# EAGLE schematic pwr (EAGLE 7.5.0)
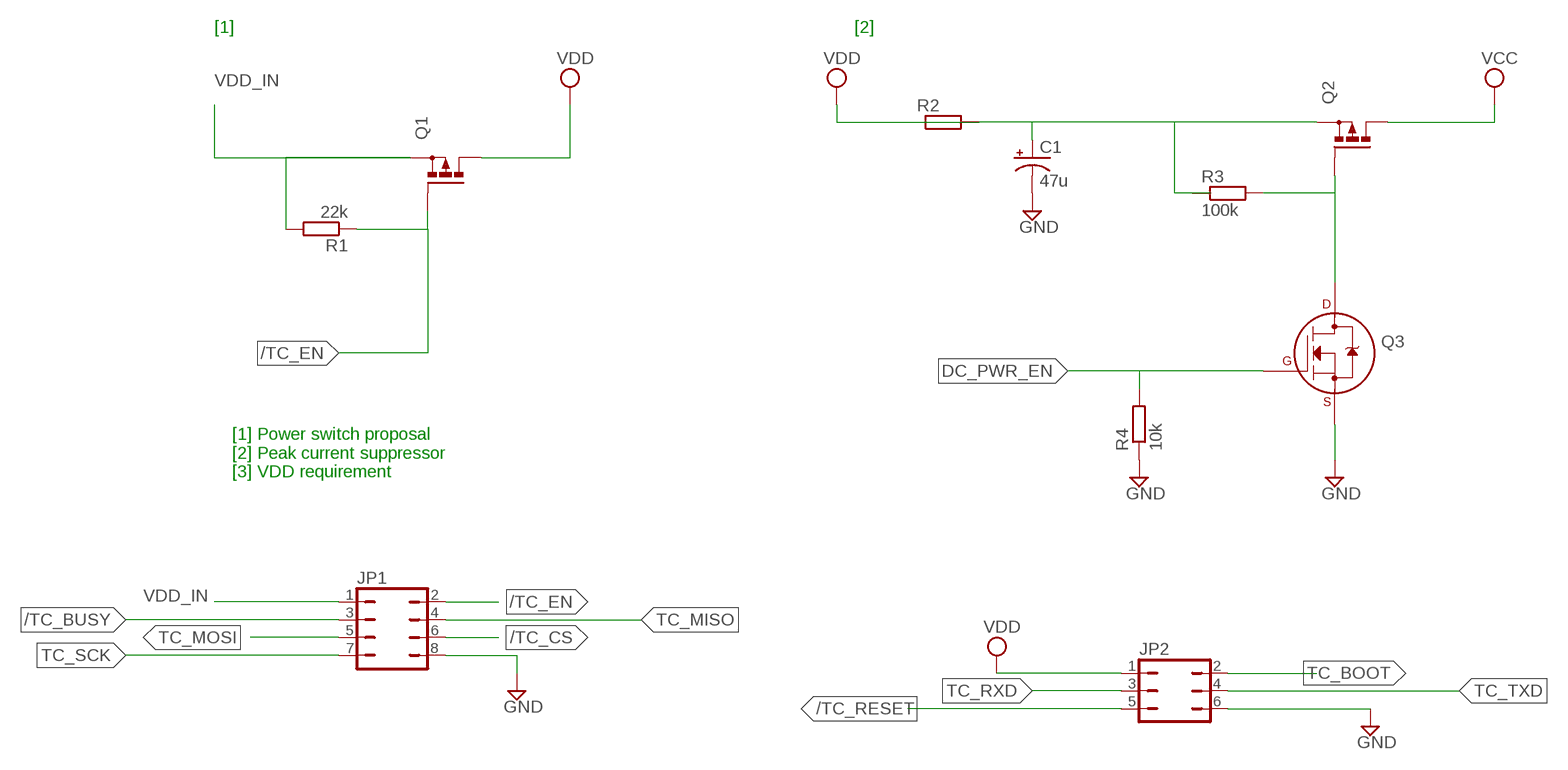
[diagram p0: schematic, sheet 1]

## Parts
C1  47u  CPOL-USB/3528-21R  [B/3528-21R]
JP1  JP4Q  [JP4Q]
JP2  JP3Q  [JP3Q]
Q1  NTR4171PTG  [SOT23]
Q2  NTR4171PTG  [SOT23]
Q3  2N7002_SOT23  [SOT-23]
R1  22k  R-EU_R0603  [R0603]
R2  R-EU_R0603  [R0603]
R3  100k  R-EU_R0603  [R0603]
R4  10k  R-EU_R0603  [R0603]

## Nets
/TC_BUSY: JP1.3
/TC_CS: JP1.6
/TC_EN: JP1.2 Q1.G R1.1
/TC_RESET: JP2.5
DC_PWR_EN: Q3.1(G) R4.2
GND: C1.- JP1.8 JP2.6 Q3.2(S) R4.1
N$2: Q2.G Q3.3(D) R3.2
TC_BOOT: JP2.2
TC_MISO: JP1.4
TC_MOSI: JP1.5
TC_RXD: JP2.3
TC_SCK: JP1.7
TC_TXD: JP2.4
VCC: Q2.D
VDD: C1.+ JP2.1 Q1.D Q2.S R2.1 R2.2
VDD_IN: JP1.1 Q1.S R1.2
Unconnected: R3.1

## Notes on the sheet
- [1] | [2]
- [1] Power switch proposal
  [2] Peak current suppressor
  [3] VDD requirement

## Library data of the parts
C1 = adafruit:CPOL-US: POLARIZED CAPACITOR, American symbol
JP1 = jumper:JP4Q: JUMPER
JP2 = jumper:JP3Q: JUMPER
Q1 Q2 = transistor-power:NTR4171PTG: Power MOSFET P-Channel
Q3 = transistors:2N700*: 2N7000, 2N7002, NDS7002A N-channel enhancement mode MOSFET
R1 = resistor:R-EU_: RESISTOR, European symbol
R2-R4 = rcl:R-EU_: RESISTOR, European symbol